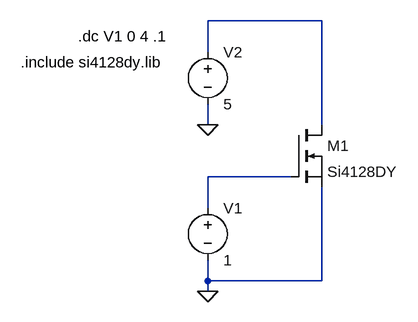
[diagram p0: schematic SI4128DY_test.asc]
SI4128DY_test.asc, the LTspice schematic file:
Version 4
SHEET 1 880 680
WIRE 320 -32 144 -32
WIRE 144 16 144 -32
WIRE 144 128 144 96
WIRE 320 128 320 -32
WIRE 272 208 144 208
WIRE 144 256 144 208
WIRE 144 368 144 336
WIRE 320 368 320 224
WIRE 320 368 144 368
WIRE 144 384 144 368
FLAG 144 384 0
FLAG 144 128 0
SYMBOL nmos 272 128 R0
SYMATTR InstName M1
SYMATTR Value Si4128DY
SYMATTR Prefix X
SYMBOL voltage 144 240 R0
SYMATTR InstName V1
SYMATTR Value 1
SYMBOL voltage 144 0 R0
SYMATTR InstName V2
SYMATTR Value 5
TEXT -56 -8 Left 0 !.dc V1 0 4 .1
TEXT -144 32 Left 0 !.include si4128dy.lib

The netlist it stands for:
* SI4128DY_test.asc
XM1 N001 N002 0 Si4128DY  ; pins D G S
V1 N002 0 1
V2 N001 0 5
.dc V1 0 4 .1
.include si4128dy.lib
.backanno
.end